# Altium project CycloneMonitor.PrjPCB (part 2 of 2)

## Sheet Sheet7.SchDoc
size A3
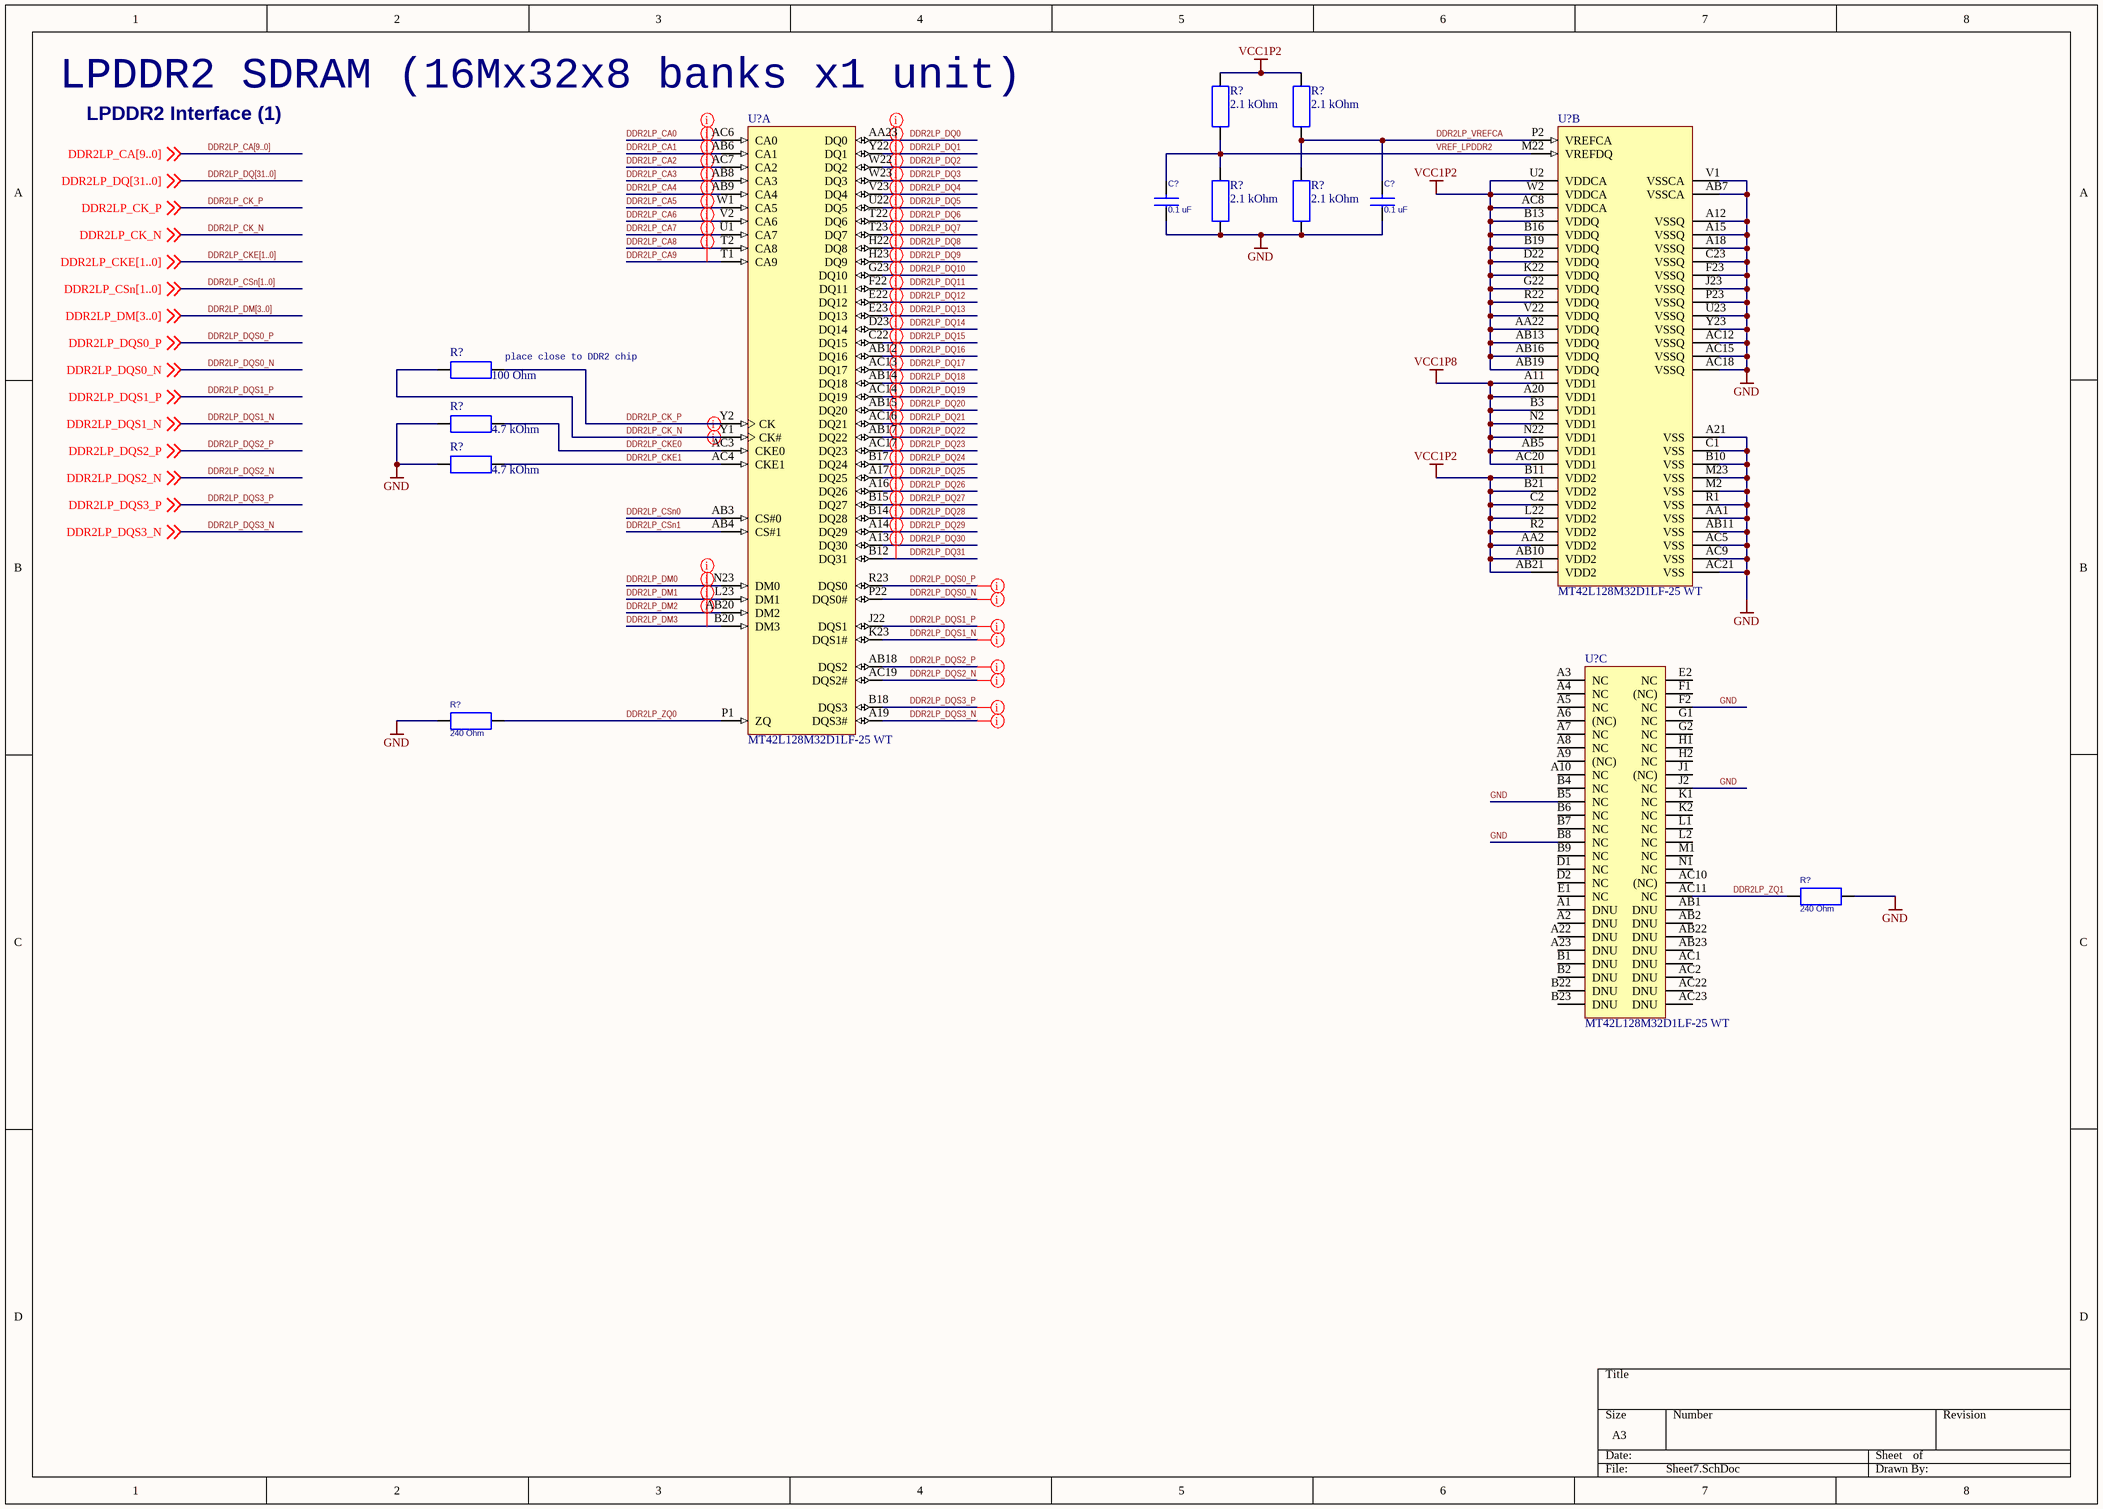
[diagram p6: Sheet7.SchDoc]

### Parts
(Parts that share a designator on the sheet are numbered #1, #2 ... from top to bottom, then left to right.)
C?#54  0.1 uF  [CAPC1608N]
C?#55  0.1 uF  [CAPC1608N]
R?#7  2.1 kOhm  [RESC1608N]
R?#8  2.1 kOhm  [RESC1608N]
R?#9  2.1 kOhm  [RESC1608N]
R?#10  2.1 kOhm  [RESC1608N]
R?#11  100 Ohm  [RESC1608N]
R?#12  4.7 kOhm  [RESC1608N]
R?#13  4.7 kOhm  [RESC1608N]
R?#14  240 Ohm  [RESC1608N]
R?#15  240 Ohm  [RESC1608N]
U?#17  MT42L128M32D1LF-25 WT  [MICT-LF-168]  (part A of 3)
U?#18  MT42L128M32D1LF-25 WT  [MICT-LF-168]  (part B of 3)
U?#19  MT42L128M32D1LF-25 WT  [MICT-LF-168]  (part C of 3)

### Nets
GND: C?#54.1 C?#55.1 R?#9.1 R?#10.1 R?#12.2 R?#13.2 R?#14.1 R?#15.2 U?#18.A12(VSSQ) U?#18.A15(VSSQ) U?#18.A18(VSSQ) U?#18.A21(VSS) U?#18.AA1(VSS) U?#18.AB7(VSSCA) U?#18.AB11(VSS) U?#18.AC5(VSS) U?#18.AC9(VSS) U?#18.AC12(VSSQ) U?#18.AC15(VSSQ) U?#18.AC18(VSSQ) U?#18.AC21(VSS) U?#18.B10(VSS) U?#18.C1(VSS) U?#18.C23(VSSQ) U?#18.F23(VSSQ) U?#18.J23(VSSQ) U?#18.M2(VSS) U?#18.M23(VSS) U?#18.P23(VSSQ) U?#18.R1(VSS) U?#18.U23(VSSQ) U?#18.V1(VSSCA) U?#18.Y23(VSSQ) U?#19.B5(NC) U?#19.B8(NC) U?#19.F2(NC) U?#19.J2(NC)
VCC1P2: R?#7.2 R?#8.2 U?#18.AA2(VDD2) U?#18.AA22(VDDQ) U?#18.AB10(VDD2) U?#18.AB13(VDDQ) U?#18.AB16(VDDQ) U?#18.AB19(VDDQ) U?#18.AB21(VDD2) U?#18.AC8(VDDCA) U?#18.B11(VDD2) U?#18.B13(VDDQ) U?#18.B16(VDDQ) U?#18.B19(VDDQ) U?#18.B21(VDD2) U?#18.C2(VDD2) U?#18.D22(VDDQ) U?#18.G22(VDDQ) U?#18.K22(VDDQ) U?#18.L22(VDD2) U?#18.R2(VDD2) U?#18.R22(VDDQ) U?#18.U2(VDDCA) U?#18.V22(VDDQ) U?#18.W2(VDDCA)
VCC1P8: U?#18.A11(VDD1) U?#18.A20(VDD1) U?#18.AB5(VDD1) U?#18.AC20(VDD1) U?#18.B3(VDD1) U?#18.N2(VDD1) U?#18.N22(VDD1)
VREF_LPDDR2: C?#54.2 R?#7.1 R?#9.2 U?#18.M22(VREFDQ)
DDR2LP_CA0: U?#17.AC6(CA0)
DDR2LP_CA1: U?#17.AB6(CA1)
DDR2LP_CA2: U?#17.AC7(CA2)
DDR2LP_CA3: U?#17.AB8(CA3)
DDR2LP_CA4: U?#17.AB9(CA4)
DDR2LP_CA5: U?#17.W1(CA5)
DDR2LP_CA6: U?#17.V2(CA6)
DDR2LP_CA7: U?#17.U1(CA7)
DDR2LP_CA8: U?#17.T2(CA8)
DDR2LP_CA9: U?#17.T1(CA9)
DDR2LP_CK_N: R?#11.2 U?#17.Y1(CK#) ; off-sheet DDR2LP_CK_N
DDR2LP_CK_P: R?#11.1 U?#17.Y2(CK) ; off-sheet DDR2LP_CK_P
DDR2LP_CKE0: R?#12.1 U?#17.AC3(CKE0)
DDR2LP_CKE1: R?#13.1 U?#17.AC4(CKE1)
DDR2LP_CSn0: U?#17.AB3(CS#0)
DDR2LP_CSn1: U?#17.AB4(CS#1)
DDR2LP_DM0: U?#17.N23(DM0)
DDR2LP_DM1: U?#17.L23(DM1)
DDR2LP_DM2: U?#17.AB20(DM2)
DDR2LP_DM3: U?#17.B20(DM3)
DDR2LP_DQ0: U?#17.AA23(DQ0)
DDR2LP_DQ1: U?#17.Y22(DQ1)
DDR2LP_DQ2: U?#17.W22(DQ2)
DDR2LP_DQ3: U?#17.W23(DQ3)
DDR2LP_DQ4: U?#17.V23(DQ4)
DDR2LP_DQ5: U?#17.U22(DQ5)
DDR2LP_DQ6: U?#17.T22(DQ6)
DDR2LP_DQ7: U?#17.T23(DQ7)
DDR2LP_DQ8: U?#17.H22(DQ8)
DDR2LP_DQ9: U?#17.H23(DQ9)
DDR2LP_DQ10: U?#17.G23(DQ10)
DDR2LP_DQ11: U?#17.F22(DQ11)
DDR2LP_DQ12: U?#17.E22(DQ12)
DDR2LP_DQ13: U?#17.E23(DQ13)
DDR2LP_DQ14: U?#17.D23(DQ14)
DDR2LP_DQ15: U?#17.C22(DQ15)
DDR2LP_DQ16: U?#17.AB12(DQ16)
DDR2LP_DQ17: U?#17.AC13(DQ17)
DDR2LP_DQ18: U?#17.AB14(DQ18)
DDR2LP_DQ19: U?#17.AC14(DQ19)
DDR2LP_DQ20: U?#17.AB15(DQ20)
DDR2LP_DQ21: U?#17.AC16(DQ21)
DDR2LP_DQ22: U?#17.AB17(DQ22)
DDR2LP_DQ23: U?#17.AC17(DQ23)
DDR2LP_DQ24: U?#17.B17(DQ24)
DDR2LP_DQ25: U?#17.A17(DQ25)
DDR2LP_DQ26: U?#17.A16(DQ26)
DDR2LP_DQ27: U?#17.B15(DQ27)
DDR2LP_DQ28: U?#17.B14(DQ28)
DDR2LP_DQ29: U?#17.A14(DQ29)
DDR2LP_DQ30: U?#17.A13(DQ30)
DDR2LP_DQ31: U?#17.B12(DQ31)
DDR2LP_DQS0_N: U?#17.P22(DQS0#) ; off-sheet DDR2LP_DQS0_N
DDR2LP_DQS0_P: U?#17.R23(DQS0) ; off-sheet DDR2LP_DQS0_P
DDR2LP_DQS1_N: U?#17.K23(DQS1#) ; off-sheet DDR2LP_DQS1_N
DDR2LP_DQS1_P: U?#17.J22(DQS1) ; off-sheet DDR2LP_DQS1_P
DDR2LP_DQS2_N: U?#17.AC19(DQS2#) ; off-sheet DDR2LP_DQS2_N
DDR2LP_DQS2_P: U?#17.AB18(DQS2) ; off-sheet DDR2LP_DQS2_P
DDR2LP_DQS3_N: U?#17.A19(DQS3#) ; off-sheet DDR2LP_DQS3_N
DDR2LP_DQS3_P: U?#17.B18(DQS3) ; off-sheet DDR2LP_DQS3_P
DDR2LP_VREFCA: C?#55.2 R?#8.1 R?#10.2 U?#18.P2(VREFCA)
DDR2LP_ZQ0: R?#14.2 U?#17.P1(ZQ)
DDR2LP_ZQ1: R?#15.1 U?#19.AC11(NC)

Not connected (* = marked no-connect by the designer): U?#19 A1(DNU) A2(DNU) A3(NC) A4(NC) A5(NC) A6((NC)) A7(NC) A8(NC) A9((NC)) A10(NC) A22(DNU) A23(DNU) AB1(DNU) AB2(DNU) AB22(DNU) AB23(DNU) AC1(DNU) AC2(DNU) AC10((NC)) AC22(DNU) AC23(DNU) B1(DNU) B2(DNU) B4(NC) B6(NC) B7(NC) B9(NC) B22(DNU) B23(DNU) D1(NC) D2(NC) E1(NC) E2(NC) F1((NC)) G1(NC) G2(NC) H1(NC) H2(NC) J1((NC)) K1(NC) K2(NC) L1(NC) L2(NC) M1(NC) N1(NC)

### Buses and harness runs
bus DDR2LP_CA[9..0]
bus DDR2LP_CKE[1..0]
bus DDR2LP_CSn[1..0]
bus DDR2LP_DM[3..0]
bus DDR2LP_DQ[31..0]

### Layout directives
net class DDR2LP_DQ: DDR2LP_DQ0, DDR2LP_DQ1, DDR2LP_DQ2, DDR2LP_DQ3, DDR2LP_DQ4, DDR2LP_DQ5, DDR2LP_DQ6, DDR2LP_DQ7, DDR2LP_DQ8, DDR2LP_DQ9, DDR2LP_DQ10, DDR2LP_DQ11, DDR2LP_DQ12, DDR2LP_DQ13, DDR2LP_DQ14, DDR2LP_DQ15, DDR2LP_DQ16, DDR2LP_DQ17, DDR2LP_DQ18, DDR2LP_DQ19, DDR2LP_DQ20, DDR2LP_DQ21, DDR2LP_DQ22, DDR2LP_DQ23, DDR2LP_DQ24, DDR2LP_DQ25, DDR2LP_DQ26, DDR2LP_DQ27, DDR2LP_DQ28, DDR2LP_DQ29, DDR2LP_DQ30, DDR2LP_DQ31
net class DDR2LP_CA: DDR2LP_CA0, DDR2LP_CA1, DDR2LP_CA2, DDR2LP_CA3, DDR2LP_CA4, DDR2LP_CA5, DDR2LP_CA6, DDR2LP_CA7, DDR2LP_CA8, DDR2LP_CA9
net class DDR2LP_DM: DDR2LP_DM0, DDR2LP_DM1, DDR2LP_DM2, DDR2LP_DM3
differential pair: DDR2LP_CK_N, DDR2LP_CK_P, DDR2LP_DQS0_N, DDR2LP_DQS0_P, DDR2LP_DQS1_N, DDR2LP_DQS1_P, DDR2LP_DQS2_N, DDR2LP_DQS2_P, DDR2LP_DQS3_N, DDR2LP_DQS3_P

### Notes on the sheet
- (near U?#17) LPDDR2 SDRAM (16Mx32x8 banks x1 unit)
- LPDDR2 Interface (1)
- (near R?#11) place close to DDR2 chip

### Library data of the parts
C?#54 C?#55 = CC0603: Vendor: DigiKey; Oper. Temp. Range: -55C to 85C; RoHS: Yes; Package: 0603
R?#7-R?#15 = RC0603: Oper. Temp. Range: -55C to 125C; RoHS: Yes; Package: 0603
U?#17-U?#19 = MT42L128M32D1LF-25 WT: 4Gb LPDDR2-800 SDRAM, 128Mb x 32, 2.5ns, 1.2V, -25 to 85 degC, 168-Ball WFBGA, Pb-Free; Manufacturer: Micron; Clock Rate: 400 MHz; Op. Temp.: -25C to +85C; DatasheetVersion: Rev.L; PackageVersion: Rev.L; PackageReference: MICT-LF-168; PackageDescription: 168-Ball Fine-Pitch Ball Grid Array, 12 x 12 mm, Pitch 0.5 mm; Cycle Time: 2.5ns; Data Rate: LPDDR2-800; Density: 4Gb; Depth: 128Mb; Package: WFBGA; Part Status: Sampling; Pin Count: 168-ball; RoHS: Yes; Technology: Mobile LPDDR2; Voltage: 1.2V; Width: x32; Mounting Technology: Surface Mount; PartNumber: MT42L128M32D1LF-25 WT; ComponentLink1Description: Manufacturer URL; ComponentLink1URL: http://www.micron.com/; ComponentLink2Description: Datasheet; ComponentLink2URL: http://www.micron.com/~/media/Documents/Products/Data%20Sheet/DRAM/Mobile%20DRAM/Low-Power%20DRAM/LPDDR2/U80M_4Gb_mobile_lpddr2_s4_sdram.pdf; ComponentLink3Description: Package Specification; ComponentLink3URL: http://www.micron.com/~/media/Documents/Products/Data%20Sheet/DRAM/Mobile%20DRAM/Low-Power%20DRAM/LPDDR2/U80M_4Gb_mobile_lpddr2_s4_sdram.pdf

## Nets that join several sheets
GND: Sheet1 (14 pins), Sheet5 (C?#1.1 U?#13.10), Sheet6 (199 pins), Sheet7 (37 pins)
VCC1P2: Sheet6 (14 pins), Sheet7 (25 pins)
VCC3P3: Sheet5 (6 pins), Sheet6 (23 pins)
VREF_LPDDR2: Sheet6 (U?#14.AC12 U?#14.AD15), Sheet7 (C?#54.2 R?#7.1 R?#9.2 U?#18.M22)
DDR2LP_CA0: Sheet1 (U?#3.AE6), Sheet7 (U?#17.AC6)
DDR2LP_CA1: Sheet1 (U?#3.AF6), Sheet7 (U?#17.AB6)
DDR2LP_CA2: Sheet1 (U?#3.AF7), Sheet7 (U?#17.AC7)
DDR2LP_CA3: Sheet1 (U?#3.AF8), Sheet7 (U?#17.AB8)
DDR2LP_CA4: Sheet1 (U?#3.U10), Sheet7 (U?#17.AB9)
DDR2LP_CA5: Sheet1 (U?#3.U11), Sheet7 (U?#17.W1)
DDR2LP_CA6: Sheet1 (U?#3.AE9), Sheet7 (U?#17.V2)
DDR2LP_CA7: Sheet1 (U?#3.AF9), Sheet7 (U?#17.U1)
DDR2LP_CA8: Sheet1 (U?#3.AB12), Sheet7 (U?#17.T2)
DDR2LP_CA9: Sheet1 (U?#3.AB11), Sheet7 (U?#17.T1)
DDR2LP_CK_N: Sheet1 (U?#3.P10), Sheet7 (R?#11.2 U?#17.Y1)
DDR2LP_CK_P: Sheet1 (U?#3.N10), Sheet7 (R?#11.1 U?#17.Y2)
DDR2LP_CKE0: Sheet1 (U?#1.AF14), Sheet7 (R?#12.1 U?#17.AC3)
DDR2LP_CKE1: Sheet1 (U?#1.AE13), Sheet7 (R?#13.1 U?#17.AC4)
DDR2LP_CSn0: Sheet1 (U?#3.R11), Sheet7 (U?#17.AB3)
DDR2LP_CSn1: Sheet1 (U?#3.T11), Sheet7 (U?#17.AB4)
DDR2LP_DM0: Sheet1 (U?#1.AF11), Sheet7 (U?#17.N23)
DDR2LP_DM1: Sheet1 (U?#1.AE18), Sheet7 (U?#17.L23)
DDR2LP_DM2: Sheet1 (U?#1.AE20), Sheet7 (U?#17.AB20)
DDR2LP_DM3: Sheet1 (U?#1.AE24), Sheet7 (U?#17.B20)
DDR2LP_DQ0: Sheet1 (U?#1.AA14), Sheet7 (U?#17.AA23)
DDR2LP_DQ1: Sheet1 (U?#1.Y14), Sheet7 (U?#17.Y22)
DDR2LP_DQ2: Sheet1 (U?#1.AD11), Sheet7 (U?#17.W22)
DDR2LP_DQ3: Sheet1 (U?#1.AD12), Sheet7 (U?#17.W23)
DDR2LP_DQ4: Sheet1 (U?#1.Y13), Sheet7 (U?#17.V23)
DDR2LP_DQ5: Sheet1 (U?#1.W12), Sheet7 (U?#17.U22)
DDR2LP_DQ6: Sheet1 (U?#1.AD10), Sheet7 (U?#17.T22)
DDR2LP_DQ7: Sheet1 (U?#1.AF12), Sheet7 (U?#17.T23)
DDR2LP_DQ8: Sheet1 (U?#1.AC15), Sheet7 (U?#17.H22)
DDR2LP_DQ9: Sheet1 (U?#1.AB15), Sheet7 (U?#17.H23)
DDR2LP_DQ10: Sheet1 (U?#1.AC14), Sheet7 (U?#17.G23)
DDR2LP_DQ11: Sheet1 (U?#1.AF13), Sheet7 (U?#17.F22)
DDR2LP_DQ12: Sheet1 (U?#1.AB16), Sheet7 (U?#17.E22)
DDR2LP_DQ13: Sheet1 (U?#1.AA16), Sheet7 (U?#17.E23)
DDR2LP_DQ14: Sheet1 (U?#1.AE14), Sheet7 (U?#17.D23)
DDR2LP_DQ15: Sheet1 (U?#1.AF18), Sheet7 (U?#17.C22)
DDR2LP_DQ16: Sheet1 (U?#1.AD16), Sheet7 (U?#17.AB12)
DDR2LP_DQ17: Sheet1 (U?#1.AD17), Sheet7 (U?#17.AC13)
DDR2LP_DQ18: Sheet1 (U?#1.AC18), Sheet7 (U?#17.AB14)
DDR2LP_DQ19: Sheet1 (U?#1.AF19), Sheet7 (U?#17.AC14)
DDR2LP_DQ20: Sheet1 (U?#1.AC17), Sheet7 (U?#17.AB15)
DDR2LP_DQ21: Sheet1 (U?#1.AB17), Sheet7 (U?#17.AC16)
DDR2LP_DQ22: Sheet1 (U?#1.AF21), Sheet7 (U?#17.AB17)
DDR2LP_DQ23: Sheet1 (U?#1.AE21), Sheet7 (U?#17.AC17)
DDR2LP_DQ24: Sheet1 (U?#1.AE15), Sheet7 (U?#17.B17)
DDR2LP_DQ25: Sheet1 (U?#1.AE16), Sheet7 (U?#17.A17)
DDR2LP_DQ26: Sheet1 (U?#1.AC20), Sheet7 (U?#17.A16)
DDR2LP_DQ27: Sheet1 (U?#1.AD21), Sheet7 (U?#17.B15)
DDR2LP_DQ28: Sheet1 (U?#1.AF16), Sheet7 (U?#17.B14)
DDR2LP_DQ29: Sheet1 (U?#1.AF17), Sheet7 (U?#17.A14)
DDR2LP_DQ30: Sheet1 (U?#1.AD23), Sheet7 (U?#17.A13)
DDR2LP_DQ31: Sheet1 (U?#1.AF23), Sheet7 (U?#17.B12)
DDR2LP_DQS0_N: Sheet1 (U?#1.W13), Sheet7 (U?#17.P22)
DDR2LP_DQS0_P: Sheet1 (U?#1.V13), Sheet7 (U?#17.R23)
DDR2LP_DQS1_N: Sheet1 (U?#1.V14), Sheet7 (U?#17.K23)
DDR2LP_DQS1_P: Sheet1 (U?#1.U14), Sheet7 (U?#17.J22)
DDR2LP_DQS2_N: Sheet1 (U?#1.W15), Sheet7 (U?#17.AC19)
DDR2LP_DQS2_P: Sheet1 (U?#1.V15), Sheet7 (U?#17.AB18)
DDR2LP_DQS3_N: Sheet1 (U?#1.W17), Sheet7 (U?#17.A19)
DDR2LP_DQS3_P: Sheet1 (U?#1.W16), Sheet7 (U?#17.B18)